# EAGLE design brenner3v3 (EAGLE 6.2)
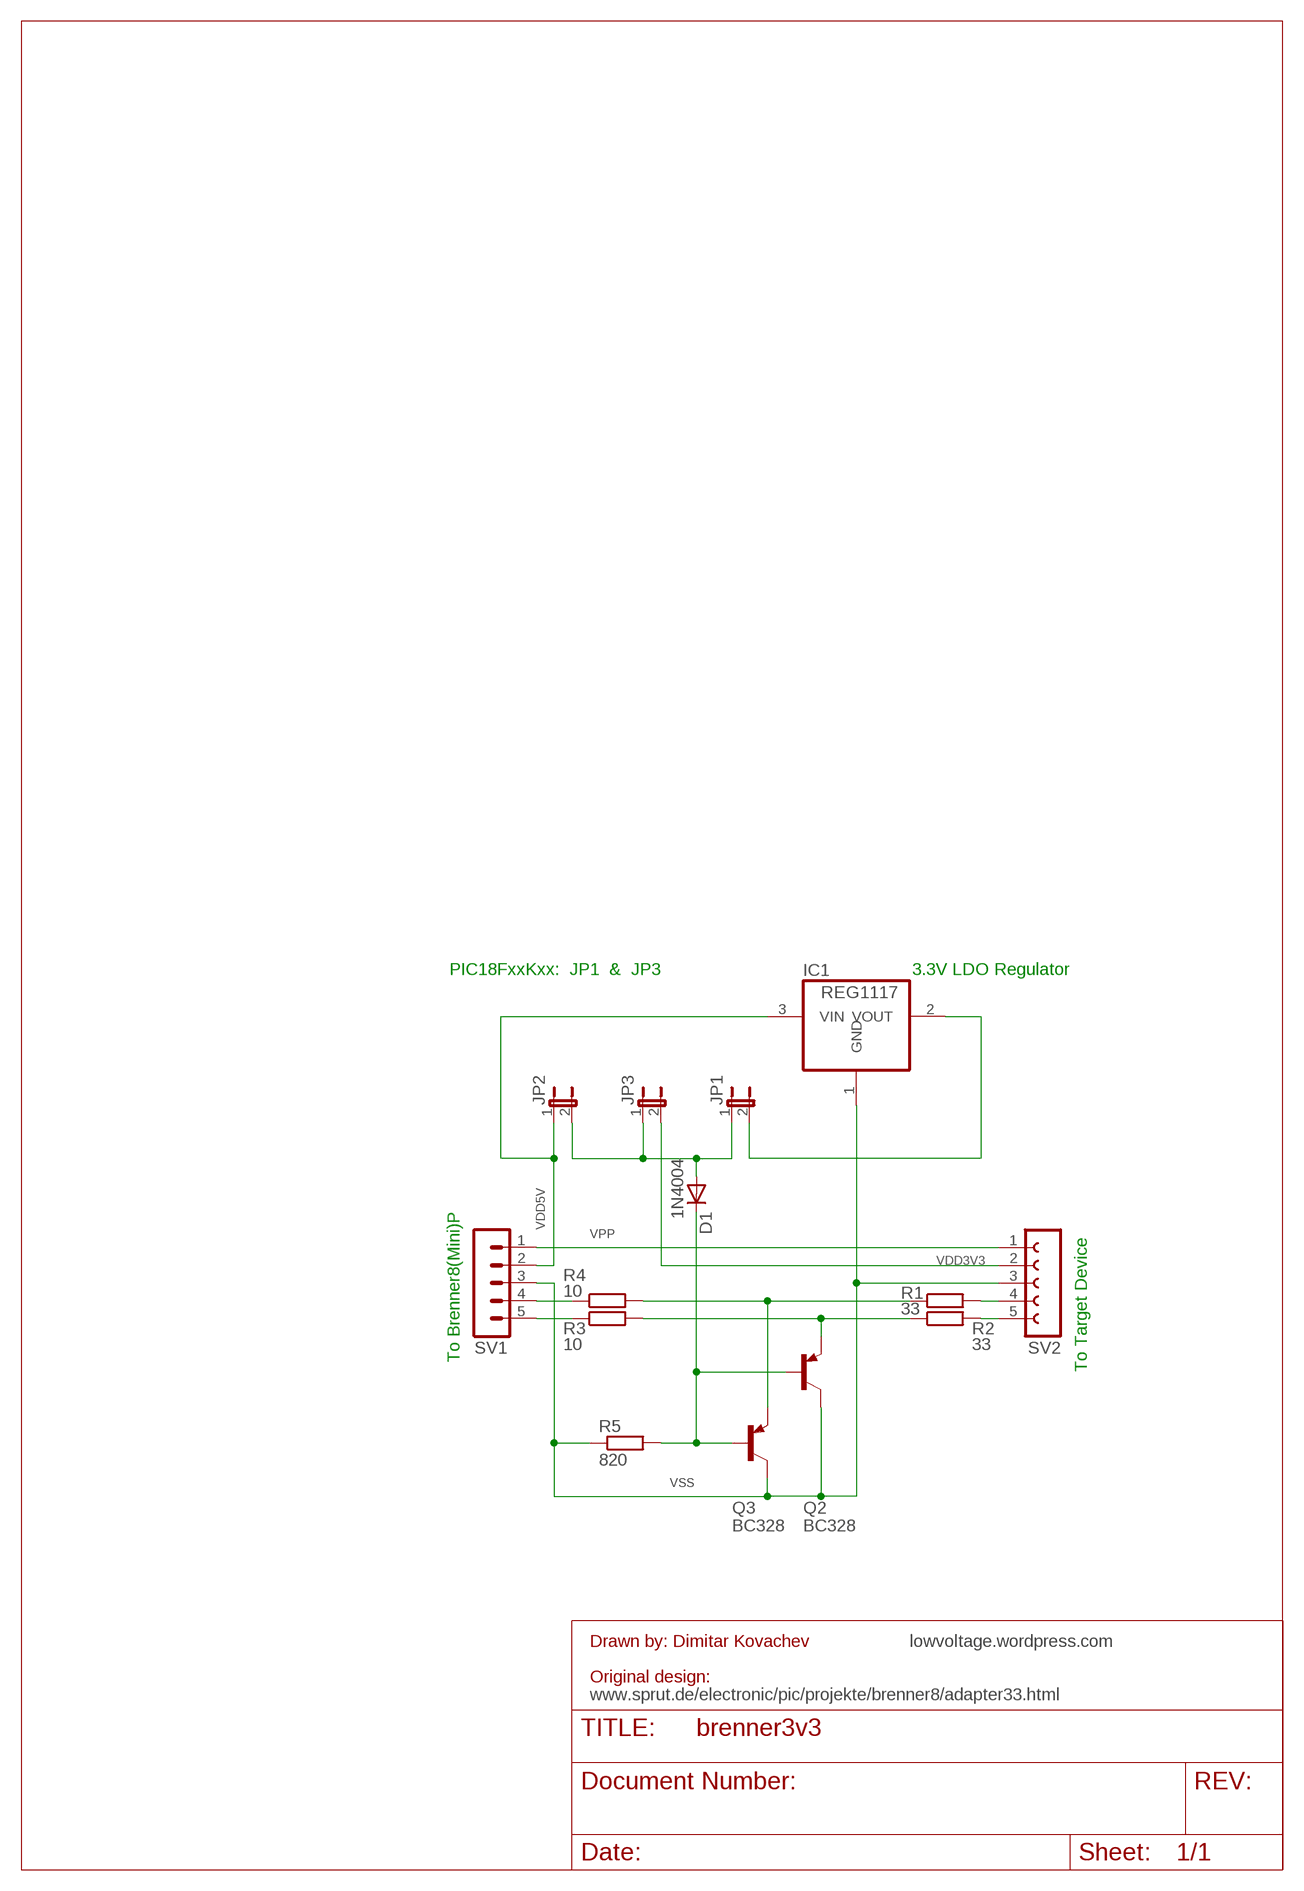
[diagram p0: schematic, sheet 1]

## Parts
D1  1N4004  [DO41-10]
IC1  REG1117  [SOT223]
JP1  JP1E  [JP1]
JP2  JP1E  [JP1]
JP3  JP1E  [JP1]
Q2  BC328  BC328-25-PNP-TO92-EBC  [TO92-EBC]
Q3  BC328  BC328-25-PNP-TO92-EBC  [TO92-EBC]
R1  33  R-EU_0207/10  [0207/10]
R2  33  R-EU_0207/10  [0207/10]
R3  10  R-EU_0207/10  [0207/10]
R4  10  R-EU_0207/10  [0207/10]
R5  820  R-EU_0207/2V  [0207/2V]
SV1  MA05-1  [MA05-1]
SV2  FE05-1  [FE05-1]

## Nets
N$1: IC1.2(VOUT) JP1.2
N$2: D1.C Q2.B Q3.B R5.2
N$4: R4.1 SV1.4
N$5: R3.1 SV1.5
N$6: Q3.E R1.1 R4.2
N$7: Q2.E R2.1 R3.2
N$8: R1.2 SV2.4
N$9: R2.2 SV2.5
N$12: D1.A JP1.1 JP2.2 JP3.1
VDD3V3: JP3.2 SV2.2
VDD5V: IC1.3(VIN) JP2.1 SV1.2
VPP: SV1.1 SV2.1
VSS: IC1.1(GND) Q2.C Q3.C R5.1 SV1.3 SV2.3

## Notes on the sheet
- PIC18FxxKxx:  JP1  &  JP3 | 3.3V LDO Regulator
- To Brenner8(Mini)P
- To Target Device
- Drawn by: Dimitar Kovachev | lowvoltage.wordpress.com
- Original design:
- www.sprut.de/electronic/pic/projekte/brenner8/adapter33.html

## Library data of the parts
D1 = diode:1N4004: DIODE general purpose rectifier, 1 A
IC1 = burr-brown:REG1117: 800mA and 1A Low Dropout (LDO) Positive Regulator 1.8V, 2.5V, 2.85V, 3.3V, 5V, and Adj; MPN: REG1117; OC_FARNELL: 1097566; OC_NEWARK: 14P6981
JP1-JP3 = jumper:JP1E: JUMPER
Q2 Q3 = transistor:*-PNP-: PNP Transistror
R1-R5 = rcl:R-EU_: RESISTOR, European symbol
SV1 = con-lstb:MA05-1: PIN HEADER; OC_FARNELL: unknown; OC_NEWARK: unknown
SV2 = con-lsta:FE05-1: FEMALE HEADER; OC_FARNELL: unknown; OC_NEWARK: unknown

## Board
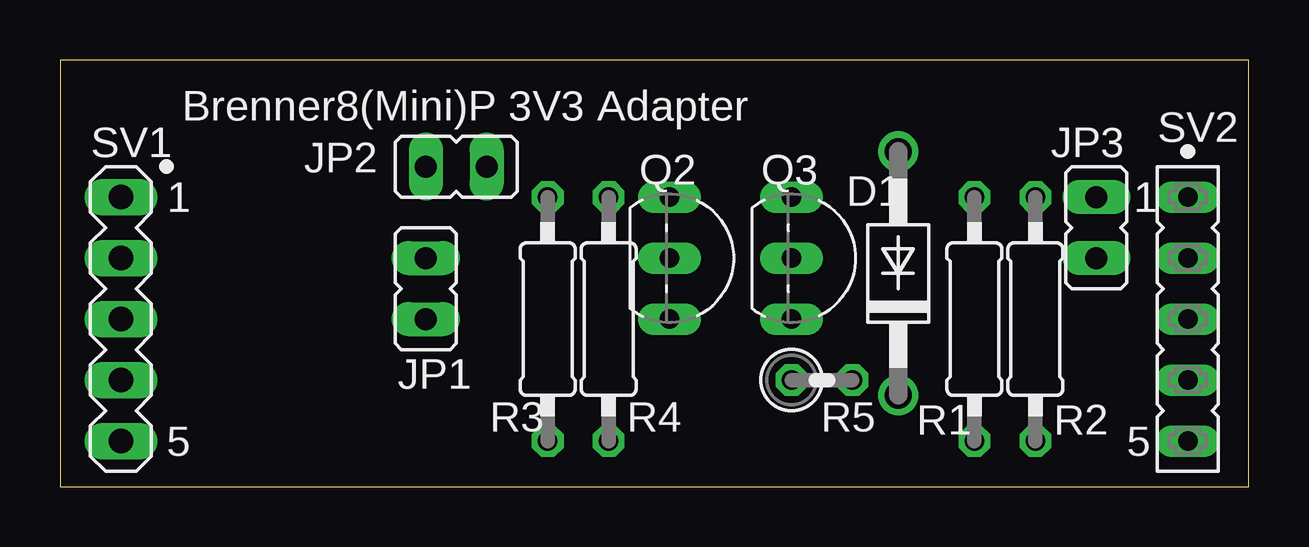
[diagram p1: board, top side]
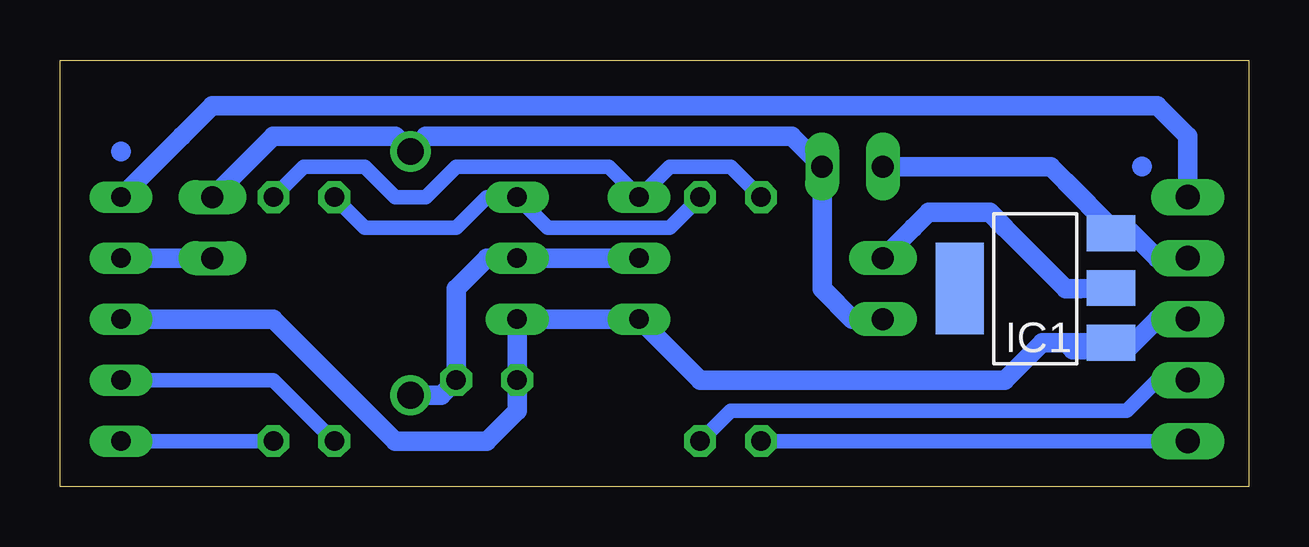
[diagram p2: board, bottom side, seen from below]

Size 49.53 x 17.78 mm. Coordinates in mm from the lower left corner, seen from the top.
Outline: 0,0 49.53,0 49.53,17.78 0,17.78 0,0
Copper layers (1*16): Top 0.035mm / dielectric 1.5mm / Bottom 0.035mm
Design rules: minimum track width 10mil, minimum drill 24mil, track to track 10mil, track to pad 10mil, pad to pad 10mil, via to via 10mil, smd to smd 8mil, copper to edge 40mil, drill to drill 8mil, minimum pad ring 10mil, minimum via ring 8mil, stop-mask expansion 4mil, vias tented up to drill 0mil, thermal gap 10mil

### Footprints (pad centres in the part's own frame; a part is rotated, then mirrored left to right if it is on the bottom)
DO41-10 = drill 1.118: A 5.08,0; C -5.08,0
SOT223 = smd 1.499 x 2.007: 1 -2.261,-3.15; 2 0.025,-3.15; 3 2.311,-3.15 | smd 3.81 x 2.007: 4 0,3.15
JP1 = drill 0.914 long: 1 0,-1.27; 2 0,1.27
TO92-EBC = drill 0.813 long: B 0,-1.27; C 2.54,-1.27; E -2.54,-1.27
0207/10 = drill 0.813 octagon: 1 -5.08,0; 2 5.08,0
0207/2V = drill 0.813 octagon: 1 -1.27,0; 2 1.27,0
MA05-1 = drill 1.016 long: 1 -5.08,0; 2 -2.54,0; 3 0,0; 4 2.54,0; 5 5.08,0
FE05-1 = drill 0.813 long: 1 -5.08,0; 2 -2.54,0; 3 0,0; 4 2.54,0; 5 5.08,0

### Placement (x,y rotation side)
D1  34.93,8.89 90 top
IC1  8.89,8.25 90 bottom
JP1  15.24,8.25 0 top
JP2  16.51,13.34 270 top
JP3  43.18,10.8 180 top
Q2  26.67,9.52 270 top
Q3  31.75,9.52 270 top
R1  38.1,6.99 270 top
R2  40.64,6.99 270 top
R3  20.32,6.99 90 top
R4  22.86,6.99 90 top
R5  31.75,4.45 0 top
SV1  2.54,6.99 270 top
SV2  46.99,6.99 270 top

### Tracks (layer width: path | path; a pad name or v marks a point on that pad's centre or on a via)
N$1
  Bottom 0.813: JP1.2 13.97,10.8 13.34,11.43 10.8,11.43 10.16,10.8 7.62,8.25 7.04,8.25 IC1.2
N$2
  Bottom 0.813: D1.C 33.66,3.81 R5.2 33.02,8.25 31.75,9.52 Q3.B Q2.B
N$4
  Bottom 0.61: SV1.4 3.81,4.45 5.08,3.17 21.59,3.17 R4.1
N$5
  Bottom 0.61: SV1.5 R3.1
N$6
  Bottom 0.61: R4.2 24.13,10.8 29.21,10.8 Q3.E 31.75,12.07 33.02,10.8 36.83,10.8 R1.1
N$7
  Bottom 0.61: R3.2 21.59,13.34 24.13,13.34 Q2.E 26.67,13.34 33.02,13.34 34.29,12.07 35.56,12.07 36.83,13.34 39.37,13.34 R2.1
N$8
  Bottom 0.61: R1.2 40.64,4.45 SV2.4
N$9
  Bottom 0.61: R2.2 SV2.5
N$12
  Bottom 0.813: JP3.1 40.64,14.61 35.56,14.61 D1.A 34.29,14.61 19.05,14.61 JP2.2 17.78,8.25 16.51,6.99 JP1.1
VDD3V3
  Bottom 0.813: JP3.2 SV2.2
VDD5V
  Bottom 0.813: SV1.2 3.81,9.52 5.08,10.8 5.51,10.8 IC1.3 5.74,10.82 7.62,12.7 8.25,13.34 JP2.1
VPP
  Bottom 0.813: SV2.1 44.45,14.61 43.18,15.88 3.81,15.88 2.54,14.61 SV1.1
VSS
  Bottom 0.813: SV2.3 40.64,6.99 35.56,1.91 31.75,1.91 30.48,3.17 Q3.C | Q3.C Q2.C 22.86,4.45 10.16,4.45 8.61,5.99 7.62,5.99 | IC1.1 7.62,5.99 | SV1.3 3.81,6.99 5.08,5.72 7.34,5.72 7.62,5.99 | Q3.C R5.1
(copper drawn outside any net)
  shapes: Bottom circle x2

### Text on the board
tPlace: Brenner8(Mini)P 3V3 Adapter | 1 | 1 | 5 | 5